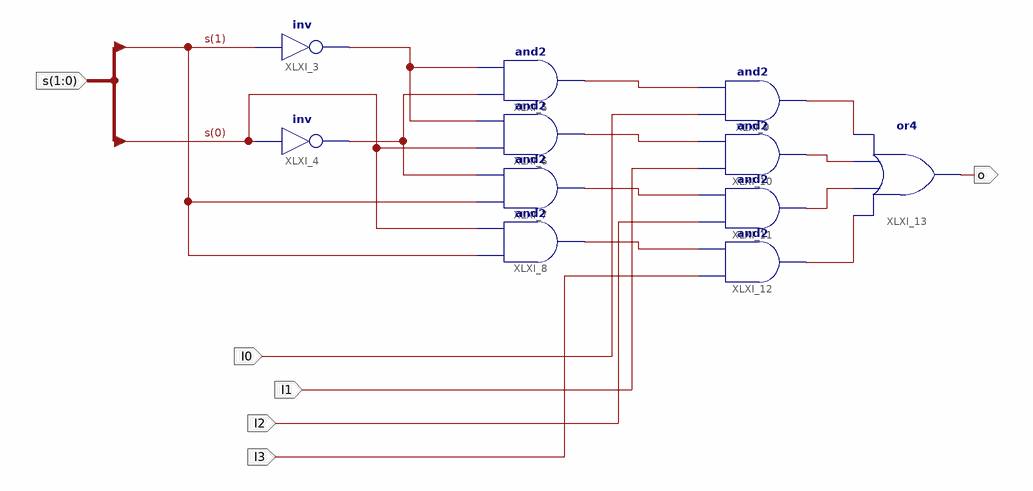
[diagram p0: schematic sheet 1]
// Xilinx ISE schematic Mux4to1.sch (kintex7) as structural Verilog: 11 symbols, 6 ports
module Mux4to1 (
  input  I0,
  input  I1,
  input  I2,
  input  I3,
  input  [1:0] s,
  output o
);

  wire XLXN_2, XLXN_4, XLXN_12, XLXN_13, XLXN_14, XLXN_15, XLXN_21, XLXN_22, XLXN_25, XLXN_26;

  not XLXI_3 (XLXN_2, s[1]);
  not XLXI_4 (XLXN_4, s[0]);
  and XLXI_5 (XLXN_12, XLXN_4, XLXN_2);
  and XLXI_6 (XLXN_13, s[0], XLXN_2);
  and XLXI_7 (XLXN_14, s[1], XLXN_4);
  and XLXI_8 (XLXN_15, s[1], s[0]);
  and XLXI_9 (XLXN_21, I0, XLXN_12);
  and XLXI_10 (XLXN_22, I1, XLXN_13);
  and XLXI_11 (XLXN_25, I2, XLXN_14);
  and XLXI_12 (XLXN_26, I3, XLXN_15);
  or XLXI_13 (o, XLXN_26, XLXN_25, XLXN_22, XLXN_21);
endmodule
